# Altium schematic sheet FLASH.SchDoc
size A4
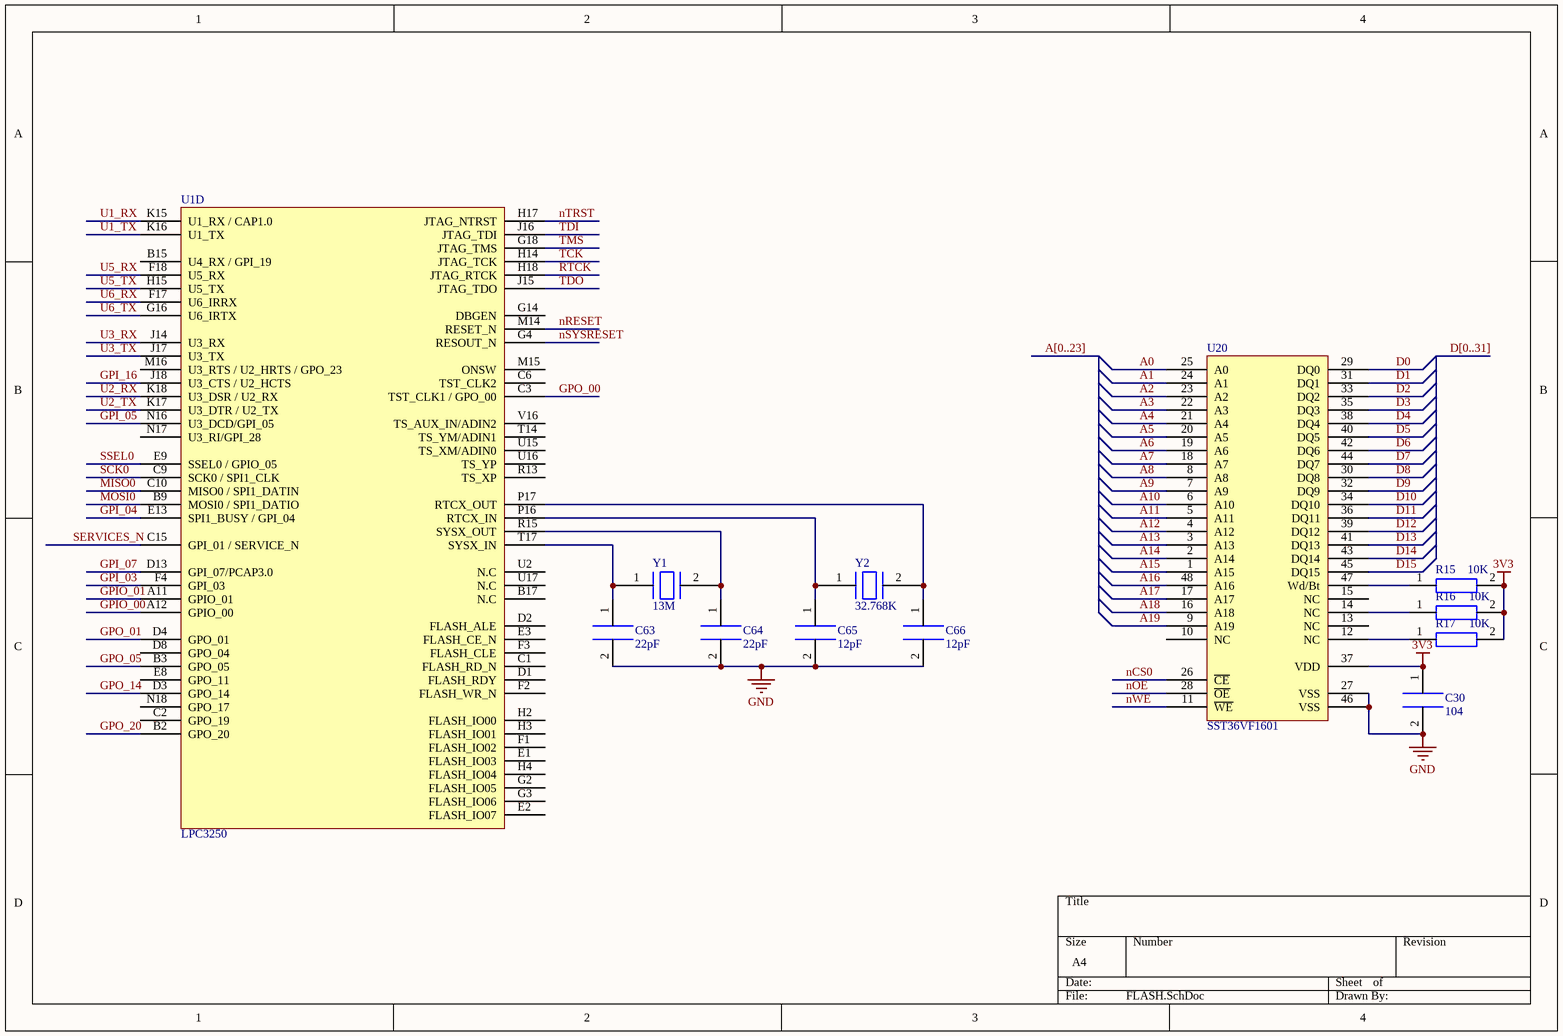
[diagram p0: FLASH.SchDoc]

## Parts
C30  104  [0603C]
C63  22pF  [0603C]
C64  22pF  [0603C]
C65  12pF  [0603C]
C66  12pF  [0603C]
R15  10K  [0603R]
R16  10K  [0603R]
R17  10K  [0603R]
U1  LPC3250  [TFBGA296]  (part D of 4)
U20  SST36VF1601  [TSOP-48]
Y1  13M  [XTAL-D]
Y2  32.768K  [XTAL-D]

## Nets
3V3: C30.1 R15.2 R16.2 R17.2 U20.37(VDD)
GND: C30.2 C63.2 C64.2 C65.2 C66.2 U20.27(VSS) U20.46(VSS)
A0: U20.25(A0)
A1: U20.24(A1)
A2: U20.23(A2)
A3: U20.22(A3)
A4: U20.21(A4)
A5: U20.20(A5)
A6: U20.19(A6)
A7: U20.18(A7)
A8: U20.8(A8)
A9: U20.7(A9)
A10: U20.6(A10)
A11: U20.5(A11)
A12: U20.4(A12)
A13: U20.3(A13)
A14: U20.2(A14)
A15: U20.1(A15)
A16: U20.48(A16)
A17: U20.17(A17)
A18: U20.16(A18)
A19: U20.9(A19)
D0: U20.29(DQ0)
D1: U20.31(DQ1)
D2: U20.33(DQ2)
D3: U20.35(DQ3)
D4: U20.38(DQ4)
D5: U20.40(DQ5)
D6: U20.42(DQ6)
D7: U20.44(DQ7)
D8: U20.30(DQ8)
D9: U20.32(DQ9)
D10: U20.34(DQ10)
D11: U20.36(DQ11)
D12: U20.39(DQ12)
D13: U20.41(DQ13)
D14: U20.43(DQ14)
D15: U20.45(DQ15)
GPI_03: U1.F4(GPI_03)
GPI_04: U1.E13(SPI1_BUSY_/_GPI_04)
GPI_05: U1.N16(U3_DCD/GPI_05)
GPI_07: U1.D13(GPI_07/PCAP3.0)
GPI_16: U1.J18(U3_CTS_/_U2_HCTS)
GPIO_00: U1.A12(GPIO_00)
GPIO_01: U1.A11(GPIO_01)
GPO_00: U1.C3(TST_CLK1_/_GPO_00)
GPO_01: U1.D4(GPO_01)
GPO_05: U1.B3(GPO_05)
GPO_14: U1.D3(GPO_14)
GPO_20: U1.B2(GPO_20)
MISO0: U1.C10(MISO0_/_SPI1_DATIN)
MOSI0: U1.B9(MOSI0_/_SPI1_DATIO)
nCS0: U20.26(~{CE})
nOE: U20.28(~{OE})
nRESET: U1.M14(RESET_N)
nSYSRESET: U1.G4(RESOUT_N)
nTRST: U1.H17(JTAG_NTRST)
nWE: U20.11(~{WE})
RTCK: U1.H18(JTAG_RTCK)
SCK0: U1.C9(SCK0_/_SPI1_CLK)
SERVICES_N: U1.C15(GPI_01_/_SERVICE_N)
SSEL0: U1.E9(SSEL0_/_GPIO_05)
TCK: U1.H14(JTAG_TCK)
TDI: U1.J16(JTAG_TDI)
TDO: U1.J15(JTAG_TDO)
TMS: U1.G18(JTAG_TMS)
U1_RX: U1.K15(U1_RX_/_CAP1.0)
U1_TX: U1.K16(U1_TX)
U2_RX: U1.K18(U3_DSR_/_U2_RX)
U2_TX: U1.K17(U3_DTR_/_U2_TX)
U3_RX: U1.J14(U3_RX)
U3_TX: U1.J17(U3_TX)
U5_RX: U1.F18(U5_RX)
U5_TX: U1.H15(U5_TX)
U6_RX: U1.F17(U6_IRRX)
U6_TX: U1.G16(U6_IRTX)
NetC63_1: C63.1 U1.T17(SYSX_IN) Y1.1
NetC64_1: C64.1 U1.R15(SYSX_OUT) Y1.2
NetC65_1: C65.1 U1.P16(RTCX_IN) Y2.1
NetC66_1: C66.1 U1.P17(RTCX_OUT) Y2.2
NetR15_1: R15.1 U20.47(Wd/Bt)
NetR16_1: R16.1 U20.14(NC)
NetR17_1: R17.1 U20.12(NC)

Not connected (* = marked no-connect by the designer): U1 B15(U4_RX_/_GPI_19) B17(N.C) C1(FLASH_RD_N) C2(GPO_19) C6(TST_CLK2) D1(FLASH_RDY) D2(FLASH_ALE) D8(GPO_04) E1(FLASH_IO03) E2(FLASH_IO07) E3(FLASH_CE_N) E8(GPO_11) F1(FLASH_IO02) F2(FLASH_WR_N) F3(FLASH_CLE) G2(FLASH_IO05) G3(FLASH_IO06) G14(DBGEN) H2(FLASH_IO00) H3(FLASH_IO01) H4(FLASH_IO04) M15(ONSW) M16(U3_RTS_/_U2_HRTS_/_GPO_23) N17(U3_RI/GPI_28) N18(GPO_17) R13(TS_XP) T14(TS_YM/ADIN1) U2(N.C) U15(TS_XM/ADIN0) U16(TS_YP) U17(N.C) V16(TS_AUX_IN/ADIN2); U20 10(NC) 13(NC) 15(NC)

## Buses and harness runs
bus A[0..23]
bus D[0..31]

## Library data of the parts
C30 C63-C66 = CAP
R15-R17 = RES
Y1 Y2 = Y